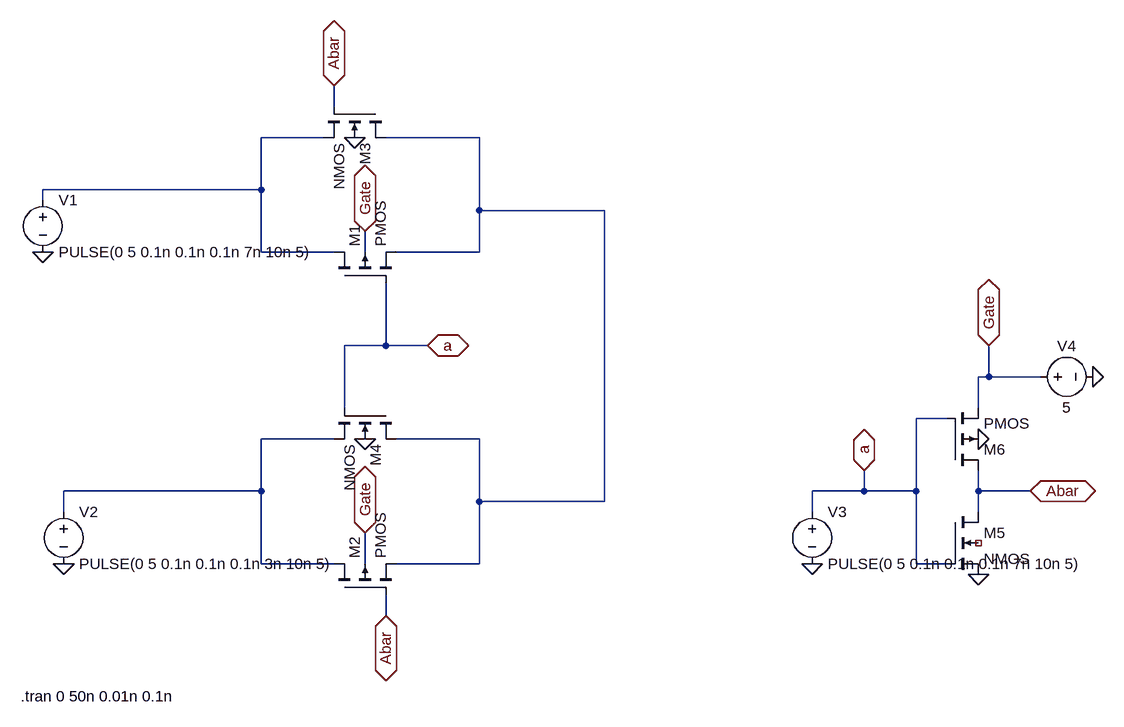
[diagram p0: schematic transmission_gate_crkt.asc]
transmission_gate_crkt.asc, the LTspice schematic file:
Version 4
SHEET 1 880 680
WIRE -352 -416 -352 -448
WIRE -368 -368 -464 -368
WIRE -128 -368 -272 -368
WIRE -464 -288 -464 -368
WIRE -464 -288 -800 -288
WIRE -800 -272 -800 -288
WIRE -128 -256 -128 -368
WIRE 64 -256 -128 -256
WIRE -464 -192 -464 -288
WIRE -352 -192 -464 -192
WIRE -304 -192 -304 -224
WIRE -128 -192 -128 -256
WIRE -128 -192 -256 -192
WIRE -272 -48 -272 -144
WIRE -272 -48 -336 -48
WIRE -208 -48 -272 -48
WIRE 656 0 656 -48
WIRE 656 0 640 0
WIRE 736 0 656 0
WIRE -336 48 -336 -48
WIRE 640 48 640 0
WIRE 592 64 544 64
WIRE -352 96 -464 96
WIRE -128 96 -256 96
WIRE -464 176 -464 96
WIRE -464 176 -768 176
WIRE 464 176 464 144
WIRE 464 176 384 176
WIRE 544 176 544 64
WIRE 544 176 464 176
WIRE 640 176 640 144
WIRE 720 176 640 176
WIRE -128 192 -128 96
WIRE 64 192 64 -256
WIRE 64 192 -128 192
WIRE -768 208 -768 176
WIRE 384 208 384 176
WIRE 640 208 640 176
WIRE -464 288 -464 176
WIRE -352 288 -464 288
WIRE -304 288 -304 240
WIRE -128 288 -128 192
WIRE -128 288 -256 288
WIRE 544 288 544 176
WIRE 592 288 544 288
WIRE -272 368 -272 336
FLAG 656 -48 Gate
IOPIN 656 -48 BiDir
FLAG -304 -224 Gate
IOPIN -304 -224 BiDir
FLAG -304 240 Gate
IOPIN -304 240 BiDir
FLAG 464 144 a
IOPIN 464 144 BiDir
FLAG -208 -48 a
IOPIN -208 -48 BiDir
FLAG 720 176 Abar
IOPIN 720 176 BiDir
FLAG -352 -448 Abar
IOPIN -352 -448 BiDir
FLAG -272 368 Abar
IOPIN -272 368 BiDir
FLAG -320 -368 0
FLAG -304 96 0
FLAG -768 288 0
FLAG -800 -192 0
FLAG 384 288 0
FLAG 640 304 0
FLAG 640 96 0
FLAG 816 0 0
SYMBOL pmos4 -352 -144 R270
SYMATTR InstName M1
SYMBOL pmos4 -352 336 R270
SYMATTR InstName M2
SYMBOL nmos4 -272 -416 R90
SYMATTR InstName M3
SYMBOL nmos4 -256 48 R90
SYMATTR InstName M4
SYMBOL nmos4 592 208 R0
SYMATTR InstName M5
SYMBOL pmos4 592 144 M180
SYMATTR InstName M6
SYMBOL voltage -800 -288 R0
WINDOW 123 0 0 Left 2
WINDOW 39 0 0 Left 2
SYMATTR InstName V1
SYMATTR Value PULSE(0 5 0.1n 0.1n 0.1n 7n 10n 5)
SYMBOL voltage -768 192 R0
WINDOW 123 0 0 Left 2
WINDOW 39 0 0 Left 2
SYMATTR InstName V2
SYMATTR Value PULSE(0 5 0.1n 0.1n 0.1n 3n 10n 5)
SYMBOL voltage 384 192 R0
WINDOW 123 0 0 Left 2
WINDOW 39 0 0 Left 2
SYMATTR InstName V3
SYMATTR Value PULSE(0 5 0.1n 0.1n 0.1n 7n 10n 5)
SYMBOL voltage 720 0 M90
WINDOW 0 -32 56 VBottom 2
WINDOW 3 32 56 VTop 2
WINDOW 123 0 0 Left 2
WINDOW 39 0 0 Left 2
SYMATTR InstName V4
SYMATTR Value 5
TEXT -834 492 Left 2 !.tran 0 50n 0.01n 0.1n

The netlist it stands for:
* transmission_gate_crkt.asc
M1 N001 a N002 Gate PMOS
M2 N003 Abar N002 Gate PMOS
M3 N002 Abar N001 0 NMOS
M4 N002 a N003 0 NMOS
M5 Abar a 0 NC_01 NMOS
M6 Abar a Gate 0 PMOS
V1 N001 0 PULSE(0 5 0.1n 0.1n 0.1n 7n 10n 5)
V2 N003 0 PULSE(0 5 0.1n 0.1n 0.1n 3n 10n 5)
V3 a 0 PULSE(0 5 0.1n 0.1n 0.1n 7n 10n 5)
V4 Gate 0 5
.model NMOS NMOS
.model PMOS PMOS
.lib standard.mos
.tran 0 50n 0.01n 0.1n
.backanno
.end